# EAGLE design MP3 Shield-v13 (EAGLE 5.10)
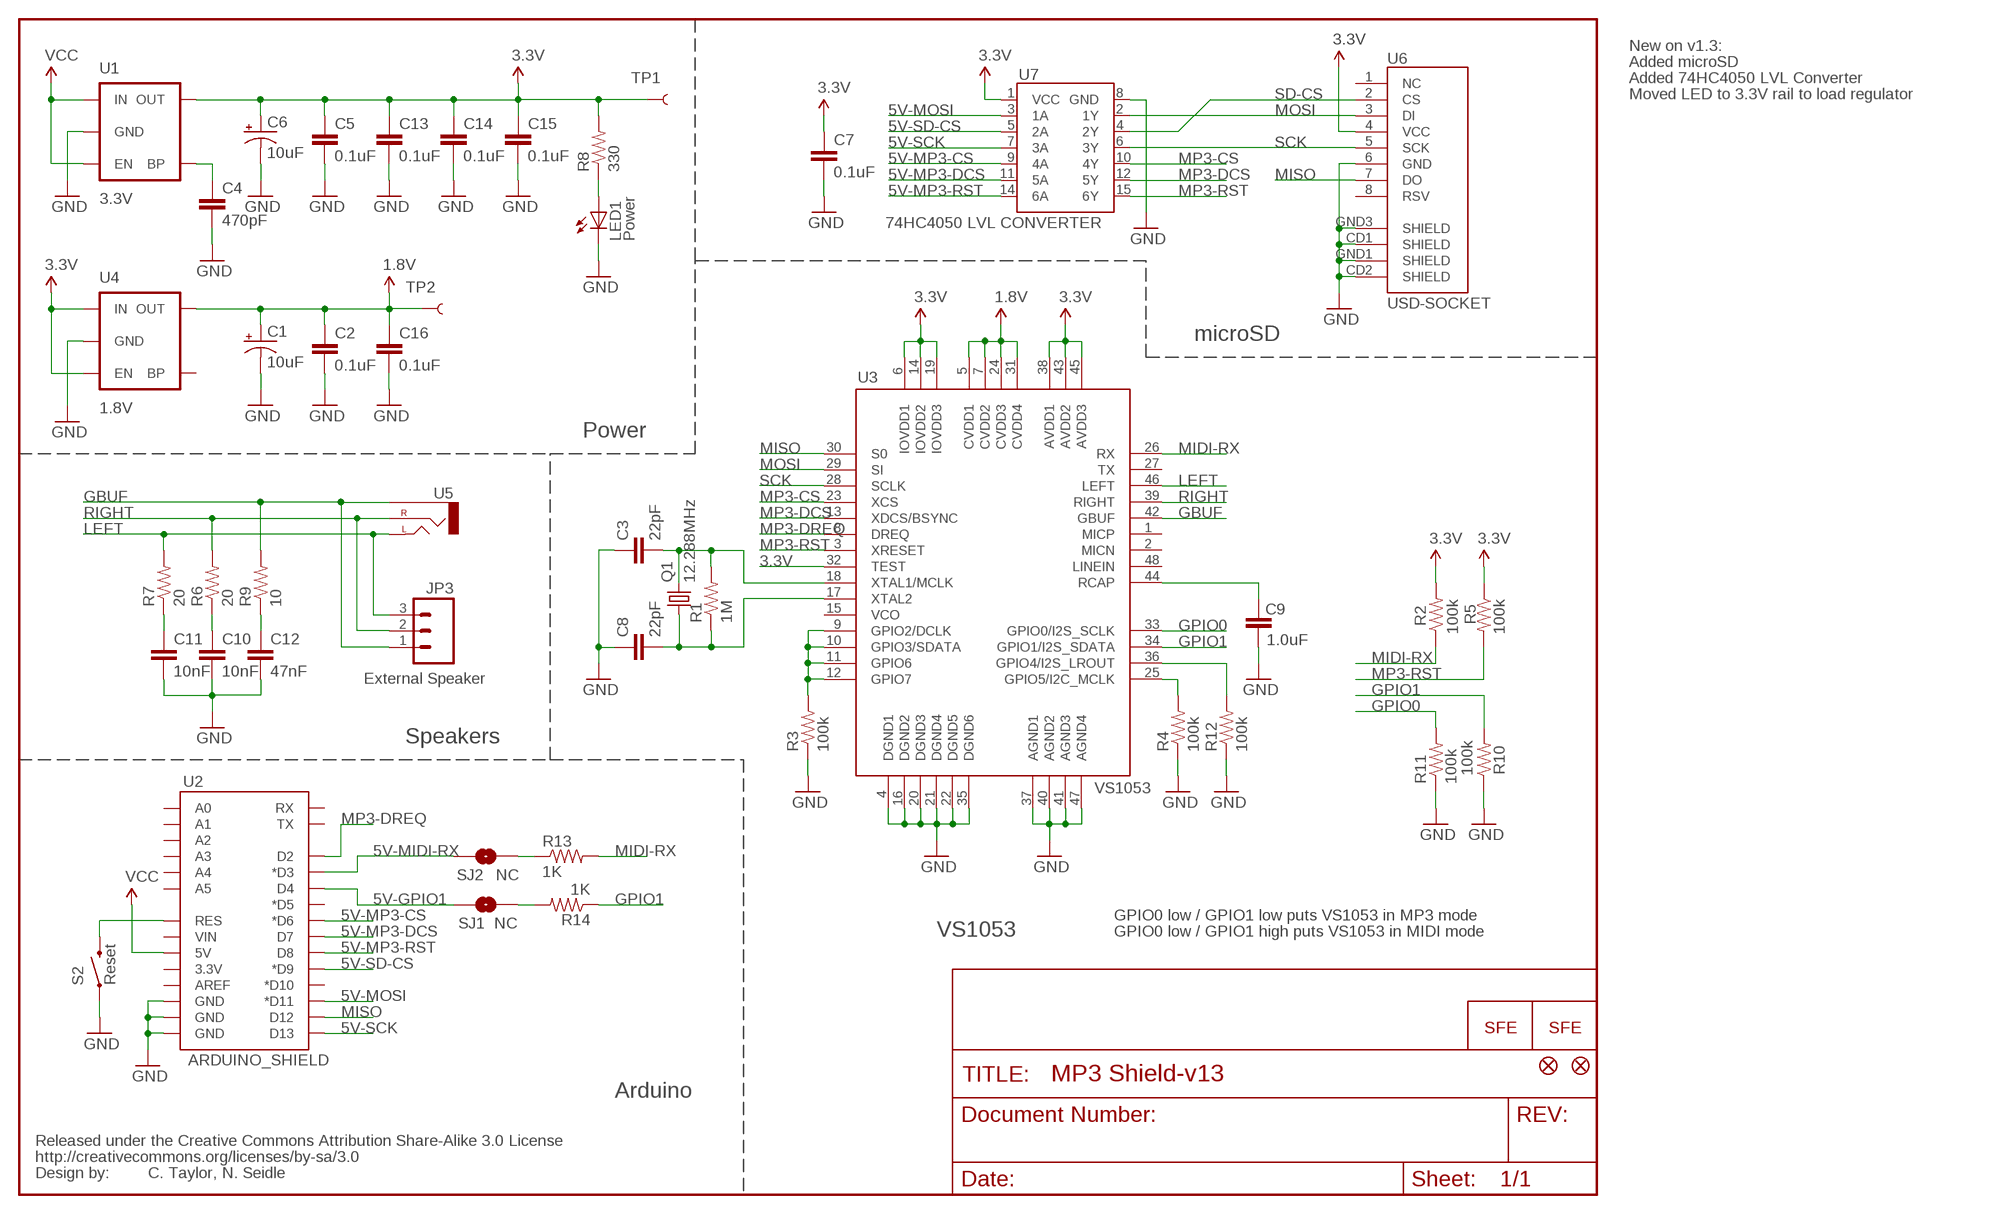
[diagram p0: schematic, sheet 1]

## Parts
C1  10uF  CAP_POL1206  [EIA3216]
C2  0.1uF  CAP0402-CAP  [0402-CAP]
C3  22pF  CAP0402-CAP  [0402-CAP]
C4  470pF  CAP0402-CAP  [0402-CAP]
C5  0.1uF  CAP0402-CAP  [0402-CAP]
C6  10uF  CAP_POL1206  [EIA3216]
C7  0.1uF  CAP0402-CAP  [0402-CAP]
C8  22pF  CAP0402-CAP  [0402-CAP]
C9  1.0uF  CAP0402-CAP  [0402-CAP]
C10  10nF  CAP0402-CAP  [0402-CAP]
C11  10nF  CAP0402-CAP  [0402-CAP]
C12  47nF  CAP0402-CAP  [0402-CAP]
C13  0.1uF  CAP0402-CAP  [0402-CAP]
C14  0.1uF  CAP0402-CAP  [0402-CAP]
C15  0.1uF  CAP0402-CAP  [0402-CAP]
C16  0.1uF  CAP0402-CAP  [0402-CAP]
JP3  External Speaker  M03PTH  [1X03]
LED1  Power  LED0603  [LED-0603]
Q1  12.288MHz  CRYSTAL5X3  [CRYSTAL-SMD-5X3]
R1  1M  RESISTOR0402-RES  [0402-RES]
R2  100k  RESISTOR0402-RES  [0402-RES]
R3  100k  RESISTOR0402-RES  [0402-RES]
R4  100k  RESISTOR0402-RES  [0402-RES]
R5  100k  RESISTOR0402-RES  [0402-RES]
R6  20  RESISTOR0402-RES  [0402-RES]
R7  20  RESISTOR0402-RES  [0402-RES]
R8  330  RESISTOR0402-RES  [0402-RES]
R9  10  RESISTOR0402-RES  [0402-RES]
R10  100k  RESISTOR0402-RES  [0402-RES]
R11  100k  RESISTOR0402-RES  [0402-RES]
R12  100k  RESISTOR0402-RES  [0402-RES]
R13  1K  RESISTOR0402-RES  [0402-RES]
R14  1K  RESISTOR0402-RES  [0402-RES]
S2  Reset  SWITCH-MOMENTARY-2SMD  [TACTILE_SWITCH_SMD]
SJ1  NC  SOLDERJUMPERTRACE  [SJ_2S-TRACE]
SJ2  NC  SOLDERJUMPERTRACE  [SJ_2S-TRACE]
TP1  TEST-POINT3X5  [PAD.03X.05]
TP2  TEST-POINT3X5  [PAD.03X.05]
U1  3.3V  V_REG_LDOSMD  [SOT23-5]
U2  ARDUINO_SHIELD  ARDUINO_SHIELDLABEL  [DUEMILANOVE_SHIELD]
U3  VS1053  VS1033  [LQFP-48]
U4  1.8V  V_REG_LDOSMD2  [SC70]
U5  AUDIO-JACKSMD2  [AUDIO-JACK-3.5MM-SMD]
U6  USD-SOCKET  USD-SOCKETNEW  [MICRO-SD-SOCKET-PP]
U7  74HC4050 LVL CONVERTER  HEX_CONVERTER  [SO016]
U$3  CREATIVE_COMMONS  [CREATIVE_COMMONS]
U$4  FIDUCIAL1X2  [FIDUCIAL-1X2]
U$5  FIDUCIAL1X2  [FIDUCIAL-1X2]
U$7  LOGO-SFENEW  [SFE-NEW-WEBLOGO]
U$8  LOGO-SFENEW  [SFE-NEW-WEBLOGO]

## Nets
1.8V: C1.A(+) C2.1 C16.1 TP2.P$1 U3.5(CVDD1) U3.7(CVDD2) U3.24(CVDD3) U3.31(CVDD4) U4.5(OUT)
3.3V: C5.1 C6.A(+) C7.1 C13.1 C14.1 C15.1 R2.2 R5.1 R8.2 TP1.P$1 U1.5(OUT) U3.6(IOVDD1) U3.14(IOVDD2) U3.19(IOVDD3) U3.32(TEST) U3.38(AVDD1) U3.43(AVDD2) U3.45(AVDD3) U4.1(IN) U4.3(EN) U6.4(VCC) U7.1(VCC)
5V-GPIO1: SJ1.2 U2.D4
5V-MIDI-RX: SJ2.1 U2.D3(*D3)
5V-MOSI: U2.D11(*D11) U7.3(1A)
5V-MP3-CS: U2.D6(*D6) U7.9(4A)
5V-MP3-DCS: U2.D7 U7.11(5A)
5V-MP3-RST: U2.D8 U7.14(6A)
5V-SCK: U2.D13 U7.7(3A)
5V-SD-CS: U2.D9(*D9) U7.5(2A)
ARST: S2.3 U2.RES
G1: R3.2 U3.9(GPIO2/DCLK) U3.10(GPIO3/SDATA) U3.11(GPIO6) U3.12(GPIO7)
G2: R4.2 U3.25(GPIO5/I2C_MCLK)
GBUF: JP3.1 R9.2 U3.42(GBUF) U5.SLEEVE
GND: C1.C(-) C2.2 C3.1 C4.2 C5.2 C6.C(-) C7.2 C8.1 C9.1 C10.2 C11.2 C12.2 C13.2 C14.2 C15.2 C16.2 LED1.C R3.1 R4.1 R10.1 R11.1 R12.1 S2.1 U1.2(GND) U2.GND@0(GND) U2.GND@1(GND) U2.GND@2(GND) U3.4(DGND1) U3.16(DGND2) U3.20(DGND3) U3.21(DGND4) U3.22(DGND5) U3.35(DGND6) U3.37(AGND1) U3.40(AGND2) U3.41(AGND3) U3.47(AGND4) U4.2(GND) U6.6(GND) U6.CD1(SHIELD) U6.CD2(SHIELD) U6.GND1(SHIELD) U6.GND3(SHIELD) U7.8(GND)
GPIO0: R11.2 U3.33(GPIO0/I2S_SCLK)
GPIO1: R10.2 R14.1 U3.34(GPIO1/I2S_SDATA)
LEFT: JP3.3 R7.2 U3.46(LEFT) U5.TIP(LEFT)
MIDI-RX: R2.1 R13.2 U3.26(RX)
MISO: U2.D12 U3.30(S0) U6.7(DO)
MOSI: U3.29(SI) U6.3(DI) U7.2(1Y)
MP3-CS: U3.23(XCS) U7.10(4Y)
MP3-DCS: U3.13(XDCS/BSYNC) U7.12(5Y)
MP3-DREQ: U2.D2 U3.8(DREQ)
MP3-RST: R5.2 U3.3(XRESET) U7.15(6Y)
N$1: C9.2 U3.44(RCAP)
N$2: C12.1 R9.1
N$3: C10.1 R6.1
N$4: R14.2 SJ1.1
N$5: C11.1 R7.1
N$6: LED1.A R8.1
N$8: R13.1 SJ2.2
N$9: C3.2 Q1.3 R1.2 U3.18(XTAL1/MCLK)
N$10: C8.2 Q1.1 R1.1 U3.17(XTAL2)
N$70: C4.1 U1.4(BP)
N$73: R12.2 U3.36(GPIO4/I2S_LROUT)
RIGHT: JP3.2 R6.2 U3.39(RIGHT) U5.RING(RIGHT)
SCK: U3.28(SCLK) U6.5(SCK) U7.6(3Y)
SD-CS: U6.2(CS) U7.4(2Y)
VCC: U1.1(IN) U1.3(EN) U2.5V
Unconnected: U2.3.3V U2.A0 U2.A1 U2.A2 U2.A3 U2.A4 U2.A5 U2.AREF U2.D5(*D5) U2.D10(*D10) U2.RX U2.TX U2.VIN U3.1(MICP) U3.2(MICN) U3.15(VCO) U3.27(TX) U3.48(LINEIN) U4.4(BP) U6.1(NC) U6.8(RSV)

## Notes on the sheet
- New on v1.3:
- Added microSD
- Added 74HC4050 LVL Converter
- Moved LED to 3.3V rail to load regulator
- microSD
- Power
- Speakers
- GPIO0 low / GPIO1 low puts VS1053 in MP3 mode
- VS1053 | GPIO0 low / GPIO1 high puts VS1053 in MIDI mode
- Arduino
- C. Taylor, N. Seidle

## Library data of the parts
C1 C6 = SparkFun:CAP_POL: Capacitor Polarized These are standard SMD and PTH capacitors. Normally 10uF, 47uF, and 100uF in electrolytic and tantalum varieties. Always verify the external diameter of the through hole cap, it varies with capacity, voltage, and manufacturer. The EIA devices should be standard.
C2-C5 C7-C16 = SparkFun:CAP: Capacitor Standard 0603 ceramic capacitor, and 0.1" leaded capacitor.
JP3 = SparkFun:M03: Header 3 Standard 3-pin 0.1" header. Use with straight break away headers (SKU : PRT-00116), right angle break away headers (PRT-00553), swiss pins (PRT-00743), machine pins (PRT-00117), and female headers (PRT-00115). Molex polarized connector foot print use with SKU : PRT-08232 with associated crimp pins and housings.
LED1 = SparkFun:LED: LEDs Standard schematic elements and footprints for 5mm, 3mm, 1206, and 0603 sized LEDs. 5mm - Spark Fun Electronics SKU : COM-00529 (and others)
Q1 = SparkFun:CRYSTAL: Crystals Various standard crystals. Proven footprints. Spark Fun Electronics SKU : COM-00534
R1-R14 = SparkFun:RESISTOR: Resistor Basic schematic elements and footprints for 0603, 1206, and PTH resistors.
S2 = SparkFun:SWITCH-MOMENTARY-2
SJ1 SJ2 = SparkFun:SOLDERJUMPER: Solder Jumper Standard SMD solder jumper. Used to automate production. Two varients : Normally Open and Normally Closed are the same, but have different paste layers. NC will have a large amount of paste and should jumper during reflow.
TP1 TP2 = SparkFun:TEST-POINT
U1 U4 = SparkFun:V_REG_LDO: Voltage Regulator LDO Standard 150mA LDO voltage regulator in SOT-23 layout. Micrel part MIC5205. BP (by-pass) pin is used to lower output noise with 470pF cap.
U2 = SparkFun:ARDUINO_SHIELD
U3 = SparkFun:VS1033
U5 = SparkFun:AUDIO-JACK: 3.5mm Audio Jack Simple 3.5mm common PCB mount audio jack. SKU: PRT-08032
U6 = SparkFun:USD-SOCKET: microSD Socket Push-push type uSD socket. Schematic element and footprint production proven. Spark Fun Electronics SKU : PRT-00127. tDoc lines correctly indicate media card edge positions when inserting (unlocked, locked, depressed).
U7 = SparkFun:HEX_CONVERTER
U$3 = SparkFun:CREATIVE_COMMONS
U$4 U$5 = SparkFun:FIDUCIAL: Fiducial Alignment Points Various fiducial points for machine vision alignment.
U$7 U$8 = SparkFun:LOGO-SFE: Spark Fun Electronics PCB Logo This is the standard Spark Fun Electronics PCB logo.

## Board
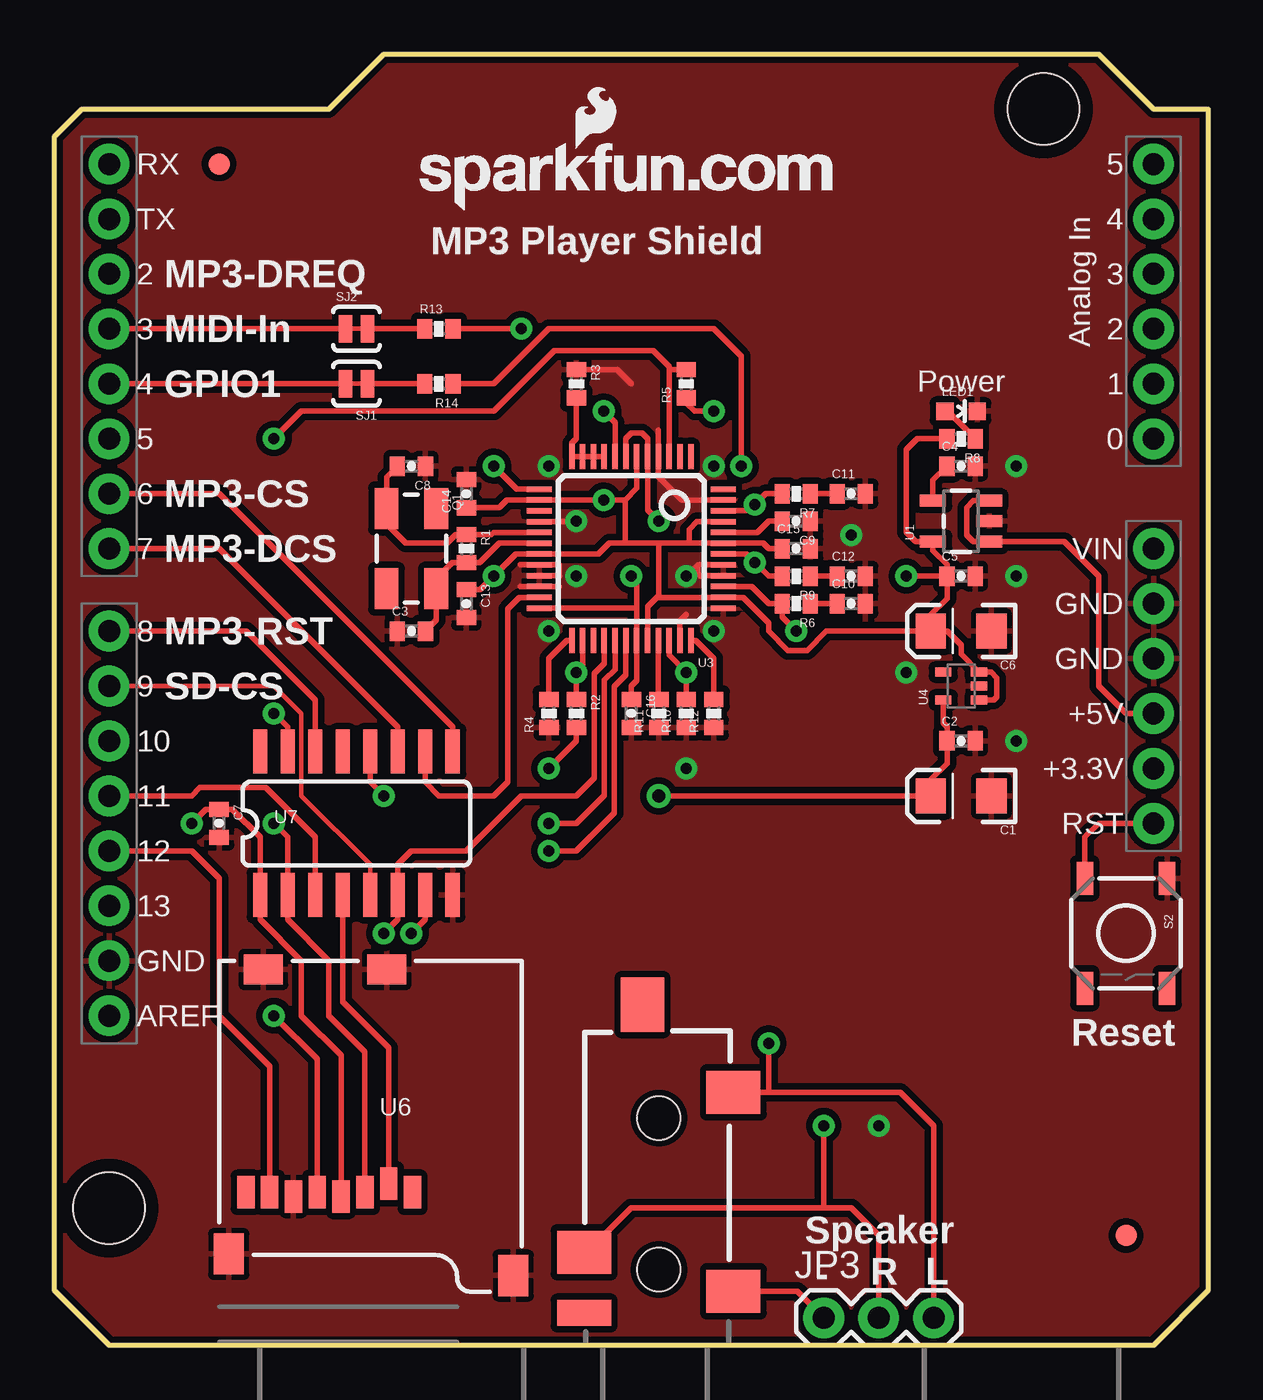
[diagram p1: board, top side]
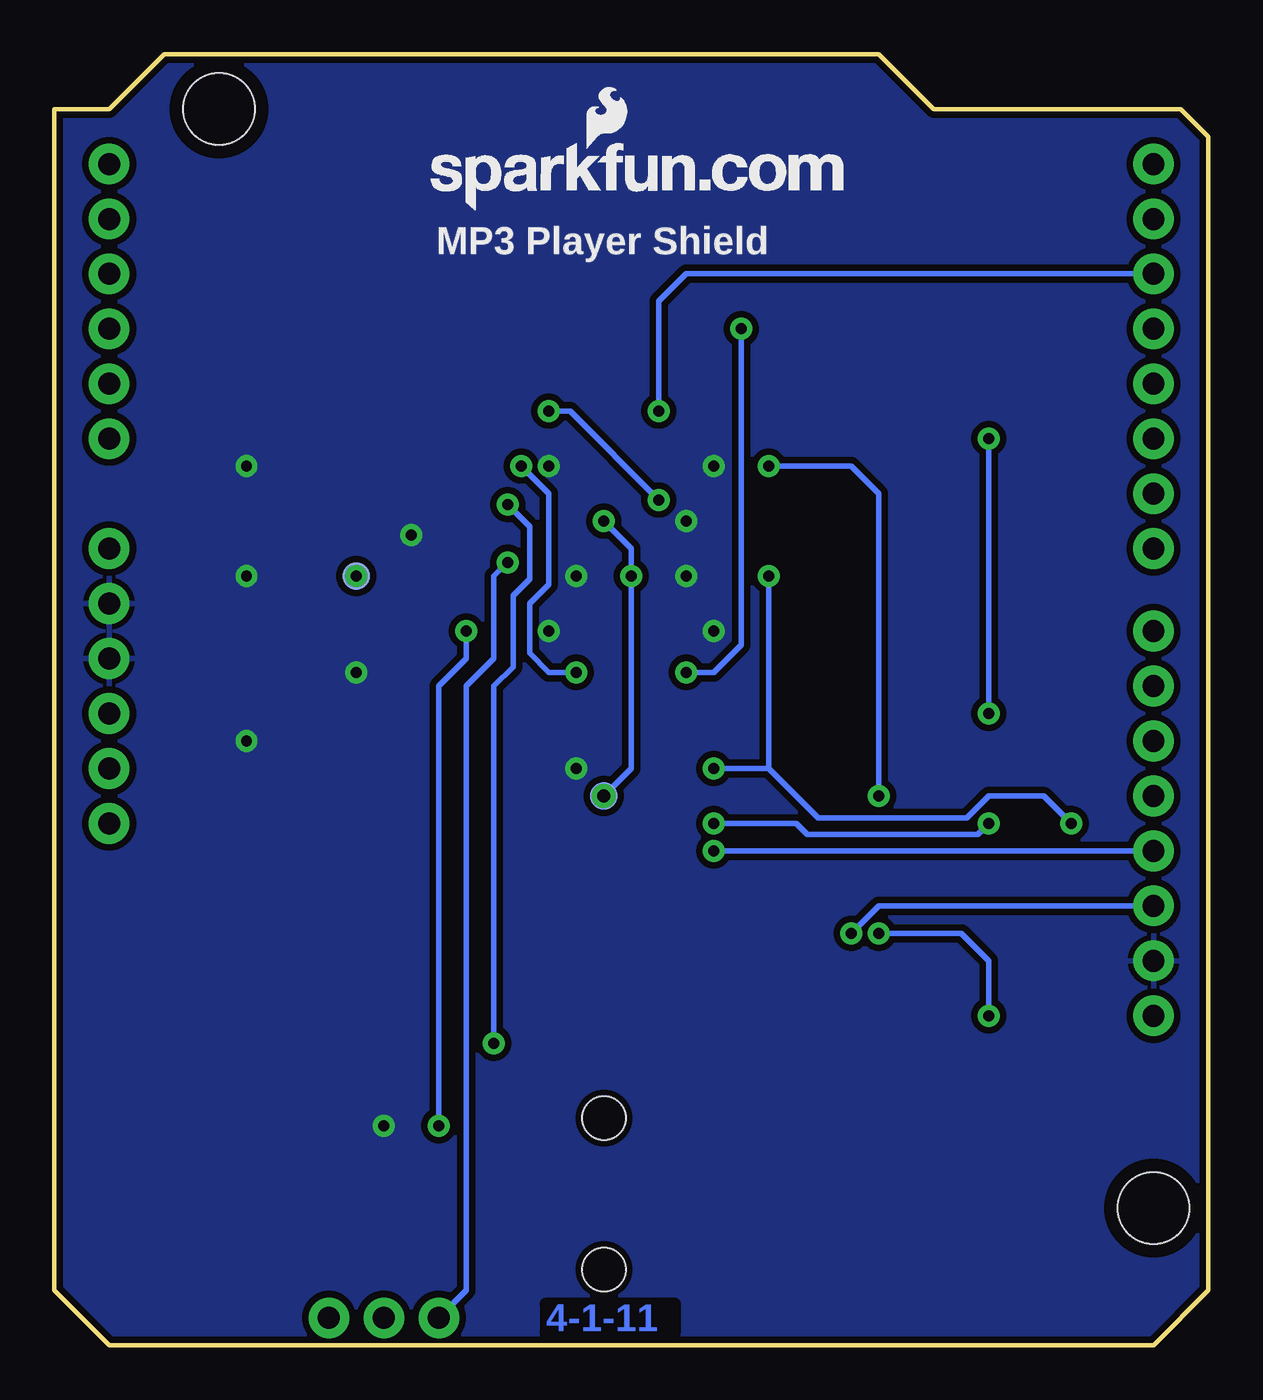
[diagram p2: board, bottom side, seen from below]

Size 53.34 x 59.69 mm. Coordinates in mm from the lower left corner, seen from the top.
Outline: 0,55.88 1.27,57.15 12.7,57.15 15.24,59.69 48.26,59.69 50.8,57.15 53.34,57.15 53.34,2.54 50.8,0 2.54,0 0,2.54 0,55.88
Copper layers (1*16): Top 0.035mm / dielectric 1.5mm / Bottom 0.035mm
Design rules "SparkFun": minimum track width 8mil, minimum drill 20mil, track to track 8mil, track to pad 8mil, pad to pad 8mil, via to via 8mil, smd to smd 8mil, copper to edge 10mil, drill to drill 8mil, minimum pad ring 12mil, minimum via ring 10mil, stop-mask expansion 4mil, vias tented up to drill 20mil, thermal gap 10mil

### Footprints (pad centres in the part's own frame; a part is rotated, then mirrored left to right if it is on the bottom)
EIA3216 = smd 1.4 x 1.6: A 1.4,0; C -1.4,0
0402-CAP = smd 0.7 x 0.9: 1 -0.65,0; 2 0.65,0
1X03 = drill 1.016 pad 1.88 round: 1 0,0; 2 2.54,0; 3 5.08,0
LED-0603 = smd 0.8 x 0.8: A 0,-0.75; C 0,0.75
CRYSTAL-SMD-5X3 = smd 1.9 x 1.1: 1 -1.85,-1.15; 2 1.85,-1.15; 3 1.85,1.15; 4 -1.85,1.15
0402-RES = smd 0.7 x 0.9: 1 -0.65,0; 2 0.65,0
TACTILE_SWITCH_SMD = smd 1.524 x 0.762: 1 -2.54,1.905; 2 2.54,1.905; 3 -2.54,-1.905; 4 2.54,-1.905
SJ_2S-TRACE = smd 0.635 x 1.27: 1 -0.508,0; 2 0.508,0
PAD.03X.05 = smd 1.27 x 1.27: P$1 0,0
SOT23-5 = smd 0.55 x 1.2: 1 -0.95,-1.3; 2 0,-1.3; 3 0.95,-1.3; 4 0.95,1.3; 5 -0.95,1.3
DUEMILANOVE_SHIELD = drill 1.016 pad 1.88 round: 3.3V 50.8,26.67; 5V 50.8,29.21; A0 50.8,41.91; A1 50.8,44.45; A2 50.8,46.99; A3 50.8,49.53; A4 50.8,52.07; A5 50.8,54.61; AREF 2.54,15.24; D2 2.54,49.53; D3 2.54,46.99; D4 2.54,44.45; D5 2.54,41.91; D6 2.54,39.37; D7 2.54,36.83; D8 2.54,33.02; D9 2.54,30.48; D10 2.54,27.94; D11 2.54,25.4; D12 2.54,22.86; D13 2.54,20.32; GND@0 50.8,31.75; GND@1 50.8,34.29; GND@2 2.54,17.78; RES 50.8,24.13; RX 2.54,54.61; TX 2.54,52.07; VIN 50.8,36.83 | hole 3.302: 45.72,57.15; 2.54,6.35
LQFP-48 = smd 0.254 x 1.143: 1 -2.75,-4.25; 2 -2.25,-4.25; 3 -1.75,-4.25; 4 -1.25,-4.25; 5 -0.75,-4.25; 6 -0.25,-4.25; 7 0.25,-4.25; 8 0.75,-4.25; 9 1.25,-4.25; 10 1.75,-4.25; 11 2.25,-4.25; 12 2.75,-4.25; 25 2.75,4.25; 26 2.25,4.25; 27 1.75,4.25; 28 1.25,4.25; 29 0.75,4.25; 30 0.25,4.25; 31 -0.25,4.25; 32 -0.75,4.25; 33 -1.25,4.25; 34 -1.75,4.25; 35 -2.25,4.25; 36 -2.75,4.25 | smd 1.143 x 0.254: 13 4.25,-2.75; 14 4.25,-2.25; 15 4.25,-1.75; 16 4.25,-1.25; 17 4.25,-0.75; 18 4.25,-0.25; 19 4.25,0.25; 20 4.25,0.75; 21 4.25,1.25; 22 4.25,1.75; 23 4.25,2.25; 24 4.25,2.75; 37 -4.25,2.75; 38 -4.25,2.25; 39 -4.25,1.75; 40 -4.25,1.25; 41 -4.25,0.75; 42 -4.25,0.25; 43 -4.25,-0.25; 44 -4.25,-0.75; 45 -4.25,-1.25; 46 -4.25,-1.75; 47 -4.25,-2.25; 48 -4.25,-2.75
SC70 = smd 0.4 x 0.75: 1 -0.65,-0.825; 2 0,-0.825; 3 0.65,-0.825; 4 0.65,0.825; 5 -0.65,0.825
AUDIO-JACK-3.5MM-SMD = smd 2 x 2.5: RING 4.3,3.45; SLEEVE 2.5,-3.45; TIP 11.7,-3.45 | smd 1.2 x 2.5: RSH 1.5,3.45 | smd 2.5 x 2: TSH 15.75,0.75 | hole 2: 3.5,0; 10.5,0
MICRO-SD-SOCKET-PP = smd 0.8 x 1.5: 1 -8.94,10.7; 2 -7.84,10.3; 3 -6.74,10.7; 4 -5.64,10.9; 5 -4.54,10.7; 6 -3.44,10.9; 7 -2.34,10.7; 8 -1.24,10.7 | smd 1.8 x 1.4: CD1 -2.05,0.4; CD2 -7.75,0.4 | smd 1.4 x 1.9: GND1 -13.6,14.55; GND3 -0.45,13.55
SO016 = smd 0.66 x 2.032: 1 -4.445,-3.315; 2 -3.175,-3.315; 3 -1.905,-3.315; 4 -0.635,-3.315; 5 0.635,-3.315; 6 1.905,-3.315; 7 3.175,-3.315; 8 4.445,-3.315; 9 4.445,3.315; 10 3.175,3.315; 11 1.905,3.315; 12 0.635,3.315; 13 -0.635,3.315; 14 -1.905,3.315; 15 -3.175,3.315; 16 -4.445,3.315
FIDUCIAL-1X2 = smd 1 x 1: 1 0,0

### Placement (x,y rotation side)
C1  41.91,25.4 180 top
C2  41.91,27.94 0 top
C3  16.51,33.02 0 top
C4  41.91,40.64 0 top
C5  41.91,35.56 0 top
C6  41.91,33.02 180 top
C7  7.62,24.13 270 top
C8  16.51,40.64 180 top
C9  34.29,38.1 180 top
C10  36.83,34.29 0 top
C11  36.83,39.37 0 top
C12  36.83,35.56 0 top
C13  19.05,34.29 270 top
C14  19.05,39.37 90 top
C15  34.29,36.83 0 top
C16  26.67,29.21 270 top
JP3  35.56,1.27 0 top
LED1  41.91,43.18 270 top
Q1  16.51,36.83 270 top
R1  19.05,36.83 270 top
R2  24.13,29.21 270 top
R3  24.13,44.45 270 top
R4  22.86,29.21 90 top
R5  29.21,44.45 90 top
R6  34.29,34.29 180 top
R7  34.29,39.37 180 top
R8  41.91,41.91 180 top
R9  34.29,35.56 180 top
R10  29.21,29.21 90 top
R11  27.94,29.21 90 top
R12  30.48,29.21 90 top
R13  17.78,46.99 0 top
R14  17.78,44.45 180 top
S2  49.53,19.05 270 top
SJ1  13.97,44.45 180 top
SJ2  13.97,46.99 0 top
TP1  39.37,35.56 0 bottom
TP2  27.94,25.4 0 bottom
U1  41.91,38.1 90 top
U2  0,0 0 top
U3  26.67,36.83 180 top
U4  41.91,30.48 90 top
U5  27.94,0 90 top
U6  7.62,17.78 180 top
U7  13.97,24.13 0 top
U$3  -19.05,-11.43 0 top  (outside the outline)
U$4  7.62,54.61 0 top
U$5  49.53,5.08 0 top
U$7  16.89,52.45 0 top
U$8  35.94,52.45 0 bottom

### Tracks (layer width: path | path; a pad name or v marks a point on that pad's centre or on a via)
1.8V  (via drill 0.51, 0.6)
  Top 0.254: U4.5 41.09,28.77 41.26,28.59 C2.1 41.26,26.91 40.51,26.16 C1.A TP2.P$1 | 26.92,34.04 U3.31 26.92,30.73 26.67,30.48 C16.1 | 26.92,34.04 26.92,35.31 v26.67,35.56 | U3.24 26.88,34.08 26.92,34.04 | v27.94,38.1 27.42,38.62 U3.5 27.42,41.92 27.18,42.16 26.67,42.16 26.42,41.91 U3.7
  Bottom 0.254: v27.94,38.1 26.67,36.83 v26.67,35.56 26.67,26.67 TP2.P$1
  other vias: 27.94,25.4
3.3V  (via drill 0.51)
  Top 0.254: C5.1 41.26,34.53 40.51,33.78 C6.A | U1.5 40.61,36.73 41.26,36.08 C5.1 | 26.42,37.08 25.65,37.08 25.15,36.58 U3.19 21.34,36.58 v20.32,35.56 19.7,34.94 C13.1 | 26.42,37.08 27.94,37.08 | 27.94,37.08 29.34,37.08 | 29.34,37.08 U3.43 32.77,37.08 33.02,36.83 C15.1 | U3.45 29.7,38.08 29.34,37.72 29.34,37.08 | 26.42,37.08 26.38,37.12 26.38,39.08 | C14.1 20.56,38.72 20.92,39.08 U3.14 v25.4,39.08 26.38,39.08 | 27.85,34.58 U3.38 31.84,34.58 33.02,33.4 33.02,33.02 33.91,32.13 34.8,32.13 35.69,33.02 C6.A | U3.32 27.42,34.15 27.85,34.58 | 27.94,37.08 27.94,34.67 27.85,34.58 | U3.6 26.92,39.62 26.38,39.08 | U4.1 43.42,29.83 43.56,29.97 43.56,30.86 43.29,31.13 U4.3 41.91,31.95 41.91,32.38 41.27,33.02 C6.A | U1.5 40.61,36.8 | C5.1 TP1.P$1 | R2.2 24.13,27.94 v22.86,26.67 | U6.4 13.26,13.41 11.43,15.24 11.43,17.78 9.53,19.68 U7.1 9.53,23.5 8.24,24.78 C7.1 7,24.78 v6.35,24.13 | U1.5 39.81,37.15 39.37,37.59 39.37,41.4 39.88,41.91 R8.2 | R5.1 29.21,43.56 29.59,43.18 v30.48,43.18
  Bottom 0.254: 20.32,26.67 v20.32,35.56 | 20.32,26.67 v22.86,26.67 | v6.35,24.13 7.62,25.4 10.16,25.4 11.18,24.38 18.03,24.38 20.32,26.67 | v30.48,43.18 29.5,43.18 v25.4,39.08
  other vias: 39.37,35.56
5V-GPIO1
  Top 0.254: U2.D4 SJ1.2
5V-MIDI-RX
  Top 0.254: U2.D3 SJ2.1
5V-MOSI
  Top 0.254: U7.3 12.06,23.5 9.78,25.78 6.73,25.78 6.35,25.4 U2.D11
5V-MP3-CS
  Top 0.254: U7.9 18.41,28.57 7.62,39.37 U2.D6
5V-MP3-DCS
  Top 0.254: U7.11 15.88,28.57 7.62,36.83 U2.D7
5V-MP3-RST
  Top 0.254: U2.D8 8.89,33.02 12.06,29.84 U7.14
5V-SCK  (via drill 0.51)
  Top 0.254: U7.7 17.14,19.68 v16.51,19.05
  Bottom 0.254: U2.D13 15.24,20.32 v16.51,19.05
5V-SD-CS
  Top 0.203: U2.D9 10.16,30.48 11.43,29.21 11.43,25.4 14.61,22.23 U7.5
ARST
  Top 0.254: S2.3 47.62,23.5 48.26,24.13 U2.RES
G1
  Top 0.254: U3.9 U3.10 U3.11 U3.12 23.92,41.7 24.13,41.91 R3.2
G2
  Top 0.254: U3.25 23.69,32.58 22.86,31.75 R4.2
GBUF  (via drill 0.51)
  Top 0.254: R9.2 33.02,35.56 v32.38,36.2 32,36.58 U3.42 | U5.SLEEVE 34.33,2.5 JP3.1
  Bottom 0.254: v32.38,36.2 33.02,35.56 33.02,31.75 34.29,30.48 34.29,2.54 JP3.1
GND  (via drill 0.51)
  Top 0.254: U3.47 28.99,39.08 27.92,40.15 U3.4 27.92,42.31 | v29.21,35.56 29.73,36.08 29.73,35.67 29.84,35.56 29.86,35.58 U3.40 | U3.35 28.92,33.49 29.21,33.78 | U3.16 24.11,38.08 v24.13,38.1 | v24.13,35.56 24.11,35.58 | 29.86,36.09 U3.41 | U3.21 23.35,35.58 | 23.35,35.58 23.37,35.56 | 21.53,36.09 23.35,36.09 23.35,35.58 | 21.53,35.07 23.35,35.07 | R3.1 26.02,45.1 26.67,44.45
  other vias: 30.48,33.02 39.37,31.11 29.21,26.67 30.48,40.64 36.83,37.47 22.86,40.64 44.45,35.56 44.45,27.94 44.45,40.64 38.1,10.16 22.86,33.02
  pour Top (isolate 0.305): 0,59.69 53.34,59.69 53.34,0 0,0
  pour Bottom (isolate 0.305): 0,0 0,59.69 53.34,59.69 53.34,0
GPIO0
  Top 0.254: U3.33 27.92,29.88 R11.2
GPIO1  (via drill 0.51)
  Top 0.254: R14.1 20.32,44.45 22.86,46.99 30.48,46.99 31.75,45.72 v31.75,40.64 | U3.34 28.42,31.91 v29.21,31.11 R10.2
  Bottom 0.254: v31.75,40.64 30.48,39.37 30.48,35.18 31.37,34.29 31.37,32 30.48,31.11 v29.21,31.11
LEFT  (via drill 0.51)
  Top 0.254: U3.46 32.1,38.58 v32.38,38.86 32.89,39.37 R7.2 | JP3.3 40.64,10.16 39.1,11.7 33.02,11.7 | 33.02,11.7 U5.TIP | 33.02,11.7 v33.02,13.97
  Bottom 0.254: v32.38,38.86 31.37,37.85 31.37,35.43 32.13,34.67 32.13,31.37 33.02,30.48 v33.02,13.97
MIDI-RX  (via drill 0.51)
  Top 0.254: v21.59,46.99 R13.2 | U3.26 24.42,31.41 v24.13,31.11 R2.1
  Bottom 0.254: v21.59,46.99 21.59,32.38 22.86,31.11 v24.13,31.11
MISO  (via drill 0.51)
  Top 0.254: U3.30 26.42,30.99 25.88,30.45 25.88,24.61 24.13,22.86 v22.86,22.86 | U6.7 9.96,12.9 7.62,15.24 7.62,21.59 6.35,22.86 U2.D12
  Bottom 0.254: U2.D12 v22.86,22.86
MOSI  (via drill 0.51)
  Top 0.254: v10.16,24.13 10.79,23.5 U7.2 10.79,19.68 12.7,17.78 12.7,15.24 14.36,13.58 U6.3 | U3.29 25.92,31.25 25.43,30.76 25.43,25.43 24.13,24.13 v22.86,24.13
  Bottom 0.254: v22.86,24.13 19.05,24.13 18.54,23.62 10.67,23.62 v10.16,24.13
MP3-CS
  Top 0.254: U3.23 21.5,34.58 20.95,34.04 20.95,26.04 20.32,25.4 17.78,25.4 17.14,26.04 U7.10
MP3-DCS  (via drill 0.51)
  Top 0.254: U7.12 14.61,26.04 v15.24,25.4 | U3.13 21.38,39.58 v20.32,40.64
  Bottom 0.254: v20.32,40.64 16.51,40.64 15.24,39.37 v15.24,25.4
MP3-DREQ  (via drill 0.51)
  Top 0.254: U3.8 25.92,42.66 v25.4,43.18
  Bottom 0.254: U2.D2 24.13,49.53 25.4,48.26 v25.4,43.18
MP3-RST  (via drill 0.51)
  Top 0.254: U7.15 10.79,28.57 v10.16,29.21 | v10.16,41.91 11.43,43.18 20.32,43.18 23.11,45.97 27.69,45.97 28.42,45.24 28.42,45.09 | 28.42,45.09 U3.3 | R5.2 28.43,45.1 28.42,45.09
  Bottom 0.254: v10.16,29.21 v10.16,41.91
N$1
  Top 0.254: U3.44 32.5,37.58 33.02,38.1 C9.2
N$2
  Top 0.254: R9.1 C12.1
N$3
  Top 0.254: R6.1 C10.1
N$4
  Top 0.254: SJ1.1 R14.2
N$5
  Top 0.254: R7.1 C11.1
N$6
  Top 0.254: LED1.A 41.29,43.18 R8.1
N$8
  Top 0.254: SJ2.2 R13.1
N$9
  Top 0.254: U3.18 20.57,37.08 19.67,36.18 R1.2 18.4,36.18 17.78,35.56 17.78,35.1 Q1.3 17.66,33.52 C3.2
N$10
  Top 0.254: U3.17 20.31,37.58 20.21,37.48 R1.1 18.56,37.48 18.16,37.08 16.26,37.08 15.24,38.1 15.24,38.56 Q1.1 15.36,40.14 C8.2
N$70
  Top 0.254: U1.4 40.61,39.99 C4.1
N$73
  Top 0.254: U3.36 29.65,32.58 30.48,31.75 R12.2
RIGHT  (via drill 0.51)
  Top 0.254: U3.39 32.23,35.08 33.02,34.29 R6.2 33.64,33.67 v34.29,33.02 | U5.RING 24.62,4.3 26.67,6.35 35.56,6.35 | 35.56,6.35 v35.56,10.16 | 35.56,6.35 36.83,6.35 38.1,5.08 JP3.2
  Bottom 0.254: v35.56,10.16 35.56,30.48 34.29,31.75 v34.29,33.02
SCK  (via drill 0.51)
  Top 0.254: v15.24,19.05 15.88,19.68 U7.6 15.88,22.23 16.51,22.86 19.05,22.86 21.59,25.4 24.13,25.4 24.97,26.24 24.97,31.06 25.42,31.52 U3.28 | U6.5 12.16,13.24 v10.16,15.24
  Bottom 0.254: v15.24,19.05 11.43,19.05 10.16,17.78 v10.16,15.24
SD-CS
  Top 0.254: U7.4 13.34,15.88 15.46,13.75 U6.2
VCC
  Top 0.254: U1.3 42.48,39.05 42.16,38.73 42.16,37.47 42.48,37.15 U1.1 46.67,37.15 48.26,35.56 48.26,30.48 49.53,29.21 U2.5V

### Text on the board
Bottom: 4-1-11
tPlace: MP3 Player Shield | MP3-DREQ | MIDI-In | GPIO1 | Power | MP3-CS | MP3-DCS | MP3-RST | SD-CS | Reset | Speaker | - | R | L | C. Taylor, N. Seidle
bPlace: MP3 Player Shield